# Altium project PCB_RawPrj.PrjPcb
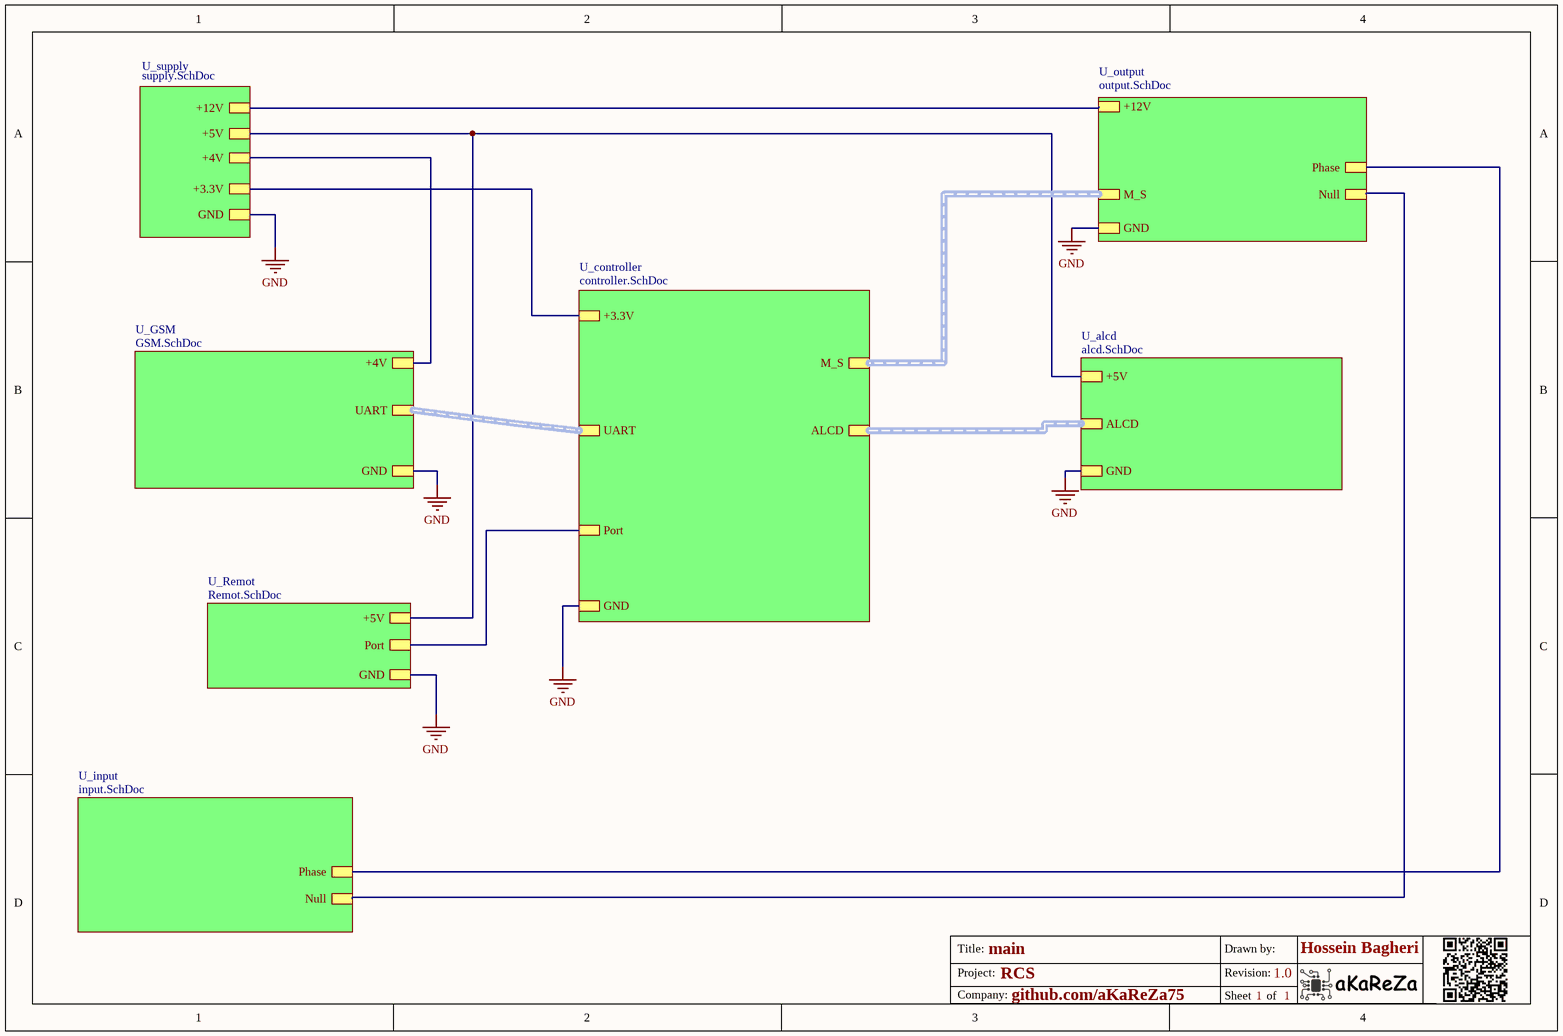
[diagram p0: main.SchDoc]
CompanyName: github.com/aKaReZa75; Project_Name: RCS; Revision: 1.0
8 sheets, 108 parts. Net scope: strictly hierarchical (ports join the sheet entries above them; power ports are local).
Board file: PCB.PcbDoc
Sheets:
  main.SchDoc
    U_alcd = alcd.SchDoc
    U_controller = controller.SchDoc
    U_GSM = GSM.SchDoc
    U_input = input.SchDoc
    U_output = output.SchDoc
    U_supply = supply.SchDoc
    U_Remot = Remot.SchDoc

## Sheet main.SchDoc: main
size A4; SheetNumber: 1; SheetTotal: 1

### Sub-sheets
U_alcd = alcd.SchDoc: GND, +5V, ALCD (harness aLCD)
U_controller = controller.SchDoc: GND, +3.3V, M_S (harness Motor signals), UART (harness UART), Port, ALCD (harness aLCD)
U_GSM = GSM.SchDoc: +4V, GND, UART (harness UART)
U_input = input.SchDoc: Null, Phase
U_output = output.SchDoc: +12V, GND, Phase, Null, M_S (harness Motor signals)
U_Remot = Remot.SchDoc: +5V, Port, GND
U_supply = supply.SchDoc: +4V, +3.3V, GND, +5V, +12V

### Nets
+3.3: sheet U_controller/+3.3V, sheet U_supply/+3.3V
+4: sheet U_GSM/+4V, sheet U_supply/+4V
+5: sheet U_alcd/+5V, sheet U_supply/+5V, sheet U_Remot/+5V
+12: sheet U_output/+12V, sheet U_supply/+12V
GND: sheet U_alcd/GND, sheet U_controller/GND, sheet U_GSM/GND, sheet U_output/GND, sheet U_supply/GND, sheet U_Remot/GND
null: sheet U_input/Null, sheet U_output/Null
phase: sheet U_input/Phase, sheet U_output/Phase
Port: sheet U_controller/Port, sheet U_Remot/Port

### Buses and harness runs
harness sheet U_alcd/ALCD = sheet U_controller/ALCD
harness sheet U_controller/M_S = sheet U_output/M_S
harness sheet U_controller/UART = sheet U_GSM/UART

### Notes on the sheet
- Title:
- Project:
- Drawn by:
- Revision:
- Hossein Bagheri
- Company:
- Sheet
- of

## Sheet alcd.SchDoc: alcd
size A4; SheetNumber: 1; SheetTotal: 1
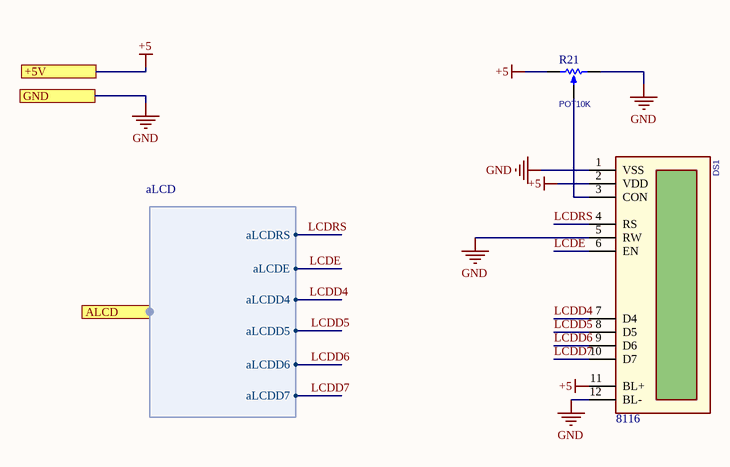
[diagram p1: alcd.SchDoc]

### Parts
DS1  Inflow: 8116  [BOX-HDR-2x6-2.54mm-S]  (hidden comment: 16x2)
R21  POT10K  [POT_3296W]

### Ports
+5V, ALCD (harness aLCD), GND

### Harnesses
aLCD: aLCDRS, aLCDE, aLCDD4, aLCDD5, aLCDD6, aLCDD7

### Nets
+5: DS1.2(VDD) DS1.11(BL+) R21.1(TOP) ; port +5V
GND: DS1.1(VSS) DS1.5(RW) DS1.12(BL-) R21.3(BOT) ; port GND
LCDD4: DS1.7(D4) ; port ALCD.aLCDD4
LCDD5: DS1.8(D5) ; port ALCD.aLCDD5
LCDD6: DS1.9(D6) ; port ALCD.aLCDD6
LCDD7: DS1.10(D7) ; port ALCD.aLCDD7
LCDE: DS1.6(EN) ; port ALCD.aLCDE
LCDRS: DS1.4(RS) ; port ALCD.aLCDRS
NetDS1_3: DS1.3(CON) R21.2(TAP)

### Notes on the sheet
- Title:
- Project:
- Drawn by:
- Revision:
- Hossein Bagheri
- Company:
- Sheet
- of

### Library data of the parts
DS1 = ModSen_LCD_CH_16x2_Box: Alphanumeric LCD character; Rating: Rating?; Validation: Valid; Value: 16x2; Package: Dip; Type: Alphanumeric
R21 = RES_THD_POT_MULTITURN: RESISTOR, THD, Potentiometer Multiturn, most Popular; VALUE: POT10K

## Sheet controller.SchDoc: supply
size A4; SheetNumber: 1; SheetTotal: 1
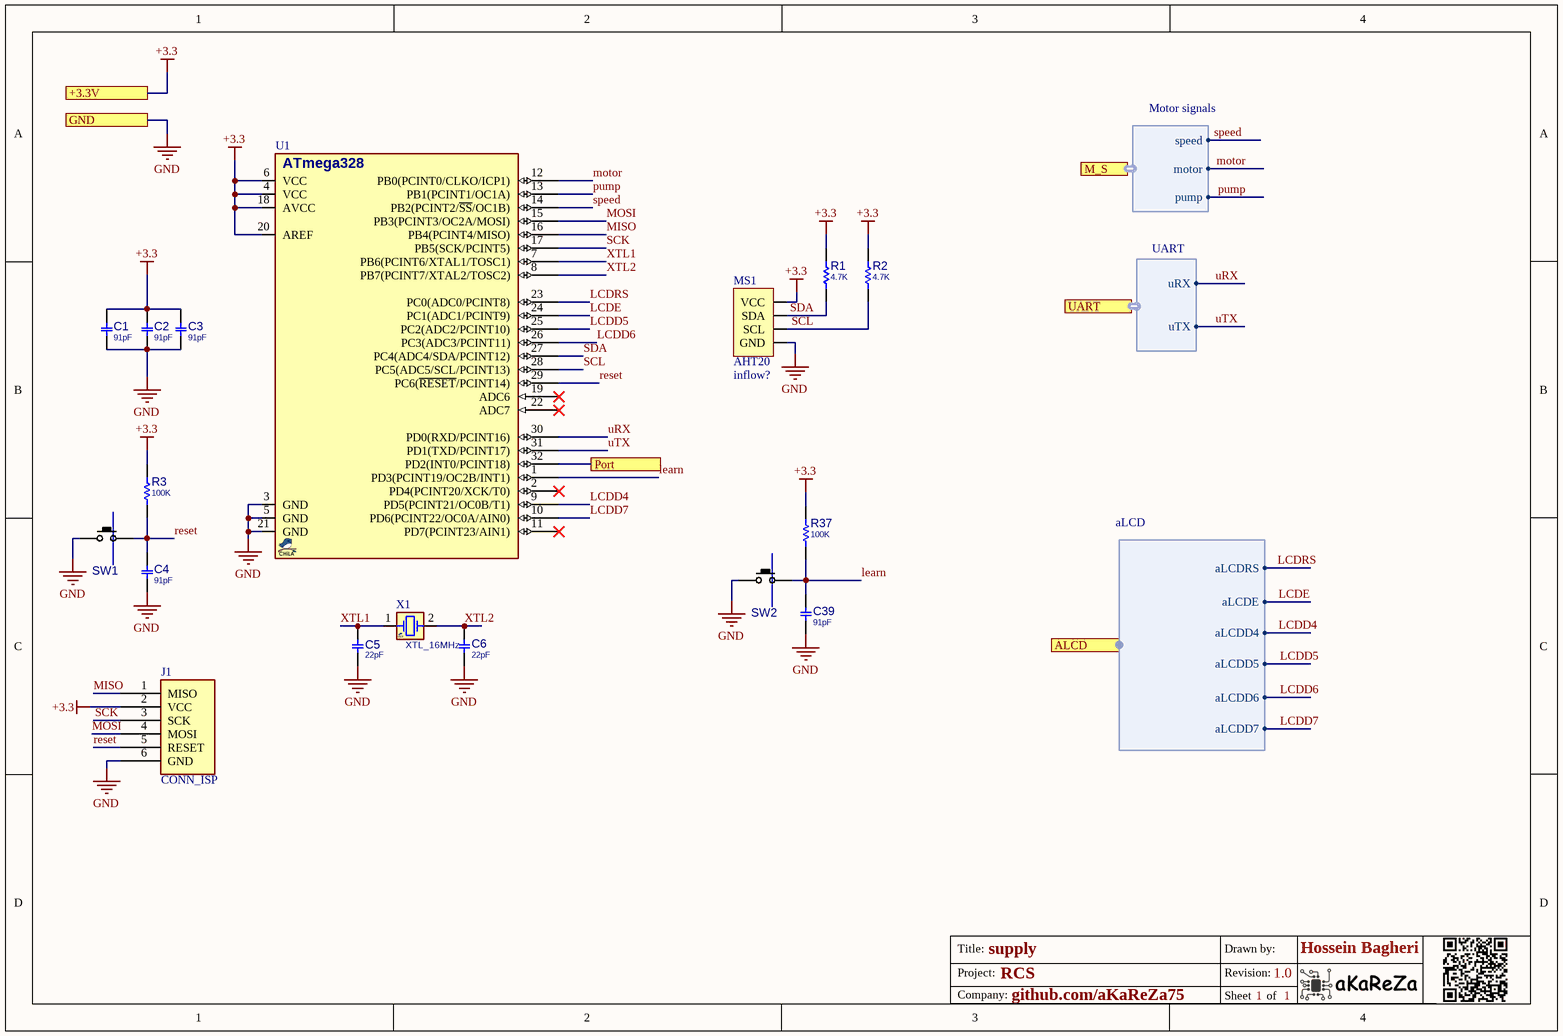
[diagram p2: controller.SchDoc]

### Parts
C1  91pF  [C0805]
C2  91pF  [C0805]
C3  91pF  [C0805]
C4  91pF  [C0805]
C5  22pF  [C0805]
C6  22pF  [C0805]
C39  91pF  [C0805]
J1  CONN_ISP  [IDC_2X3]
MS1  Inflow: inflow?  [AHT20]  (hidden comment: AHT20)
R1  4.7K  [R0805]
R2  4.7K  [R0805]
R3  100K  [R0805]
R37  100K  [R0805]
SW1  PUSHBUTTON  [SWPBS_SPST_6X3X2]  (value not drawn)
SW2  PUSHBUTTON  [SWPBS_SPST_6X3X2]  (value not drawn)
U1  ATMEGA328  [QFG80_32]  (value not drawn)
X1  XTL_16MHz  [XTL_2_11X5]

### Ports
+3.3V, ALCD (harness aLCD), GND, M_S (harness Motor signals), Port, UART (harness UART)

### Harnesses
Motor signals: speed, motor, pump
UART: uRX, uTX
aLCD: aLCDRS, aLCDE, aLCDD4, aLCDD5, aLCDD6, aLCDD7

### Nets
+3.3: C1.2 C2.2 C3.2 J1.2(VCC) MS1.4(VCC) R1.2 R2.2 R3.2 R37.2 U1.4(VCC) U1.6(VCC) U1.18(AVCC) U1.20(AREF) ; port +3.3V
GND: C1.1 C2.1 C3.1 C4.1 C5.1 C6.1 C39.1 J1.6(GND) MS1.3(GND) SW1.1(P1) SW2.1(P1) U1.3(GND) U1.5(GND) U1.21(GND) ; port GND
LCDD4: U1.9(PD5(PCINT21/OC0B/T1)) ; port ALCD.aLCDD4
LCDD5: U1.25(PC2(ADC2/PCINT10)) ; port ALCD.aLCDD5
LCDD6: U1.26(PC3(ADC3/PCINT11)) ; port ALCD.aLCDD6
LCDD7: U1.10(PD6(PCINT22/OC0A/AIN0)) ; port ALCD.aLCDD7
LCDE: U1.24(PC1(ADC1/PCINT9)) ; port ALCD.aLCDE
LCDRS: U1.23(PC0(ADC0/PCINT8)) ; port ALCD.aLCDRS
learn: C39.2 R37.1 SW2.2(P3) U1.1(PD3(PCINT19/OC2B/INT1))
MISO: J1.1(MISO) U1.16(PB4(PCINT4/MISO))
MOSI: J1.4(MOSI) U1.15(PB3(PCINT3/OC2A/MOSI))
motor: U1.12(PB0(PCINT0/CLKO/ICP1)) ; port M_S.motor
Port: U1.32(PD2(INT0/PCINT18)) ; port Port
pump: U1.13(PB1(PCINT1/OC1A)) ; port M_S.pump
reset: C4.2 J1.5(RESET) R3.1 SW1.2(P3) U1.29(PC6(~{RESET}/PCINT14))
SCK: J1.3(SCK) U1.17(PB5(SCK/PCINT5))
SCL: MS1.2(SCL) R2.1 U1.28(PC5(ADC5/SCL/PCINT13))
SDA: MS1.1(SDA) R1.1 U1.27(PC4(ADC4/SDA/PCINT12))
speed: U1.14(PB2(PCINT2/~{SS}/OC1B)) ; port M_S.speed
uRX: U1.30(PD0(RXD/PCINT16)) ; port UART.uRX
uTX: U1.31(PD1(TXD/PCINT17)) ; port UART.uTX
XTL1: C5.2 U1.7(PB6(PCINT6/XTAL1/TOSC1)) X1.1(OSC1)
XTL2: C6.2 U1.8(PB7(PCINT7/XTAL2/TOSC2)) X1.2(OSC2)

Not connected (* = marked no-connect by the designer): U1 2(PD4(PCINT20/XCK/T0))* 11(PD7(PCINT23/AIN1))* 19(ADC6)* 22(ADC7)*

### Notes on the sheet
- Title:
- Project:
- Drawn by:
- Revision:
- Hossein Bagheri
- Company:
- Sheet
- of
- (in symbol ATMEGA328_QFP32) ATmega328

### Library data of the parts
C1-C6 C39 = CAP_SMD_MLCC_2.2u50V_0805: CAP, MLCC; MANF_P#: UMK212ABJ225KG-T; MANF: Taiyo Yuden; PARAM: X5R, 10%; DIST#: MOUSER; PARAM2: 50V; ASSEMBLY: ASSEMBLY; PRICE: 100= 10$; DESC: CAP, MLCC
  C1-C4 C39: VALUE: 91pF
  C5 C6: VALUE: 22pF
J1 = CONN_AVR_ISP_IDC6: CONN, ISP, AVR , HEADER BOX; VALUE: CONN_ISP
MS1 = ModSen_AHT20: Air Temperature and Humidity Sensor; Rating: Rating?; Validation: Valid; Package: Dip; Type: Air T&H; Value: AHT20
R1-R3 R37 = RES_SMD_0805: RESISTOR, SMD; PARAM: -W; DESC: DESCRIPTION; DIST#: MOUSER; PARAM2: 1%; MANF_P#: -; MANF: -; ASSEMBLY: ASSEMBLY; PRICE: 100= 0.5$
  R1 R2: VALUE: 4.7K
  R3 R37: VALUE: 100K
SW1 SW2 = SWPBS_SPST_6X3X2_RS282: SWITCH, PUSH BUTTON, TACTILE, SMD, SPST, 6X3.5X2.5mm; MANF: C&K; DESC: DESCRIPTION; MANF_P#: RS-282G05A3-SM RT; VALUE: PUSHBUTTON; ASSEMBLY: ASSEMBLY; PARAM: PARAM; PRICE: 0.8$
U1 = ATMEGA328_QFP32: MCU, AVR, 8-Bit, 16KB, 1KB RAM, 20MHz; PART#ALT: ATmega8-48-88-168-328; MANF_P#: ATMEGA328-AU; DESC: 1KB EEPROM; MANF: ATMEL/MICROCHIP; PARAM2: 1.8~5.5V; PARAM: 32KB, 2KB RAM, 20MHz, -40~85°C; PRICE: 2.2$; VALUE: ATMEGA328
X1 = XTL_2_HC49_8MHz_SMD: Crystal MOST POPULAR ABL HC49 PACKAGE; MANF: ABRACON; MANF_P#: ABLS-8.000MHZ-B4-T; PARAM: 8MHz, 18pF, 30PPM, -20~70oC; PRICE: 0.3$; VALUE: XTL_16MHz

## Sheet GSM.SchDoc: GSM
size A4; SheetNumber: 1; SheetTotal: 1
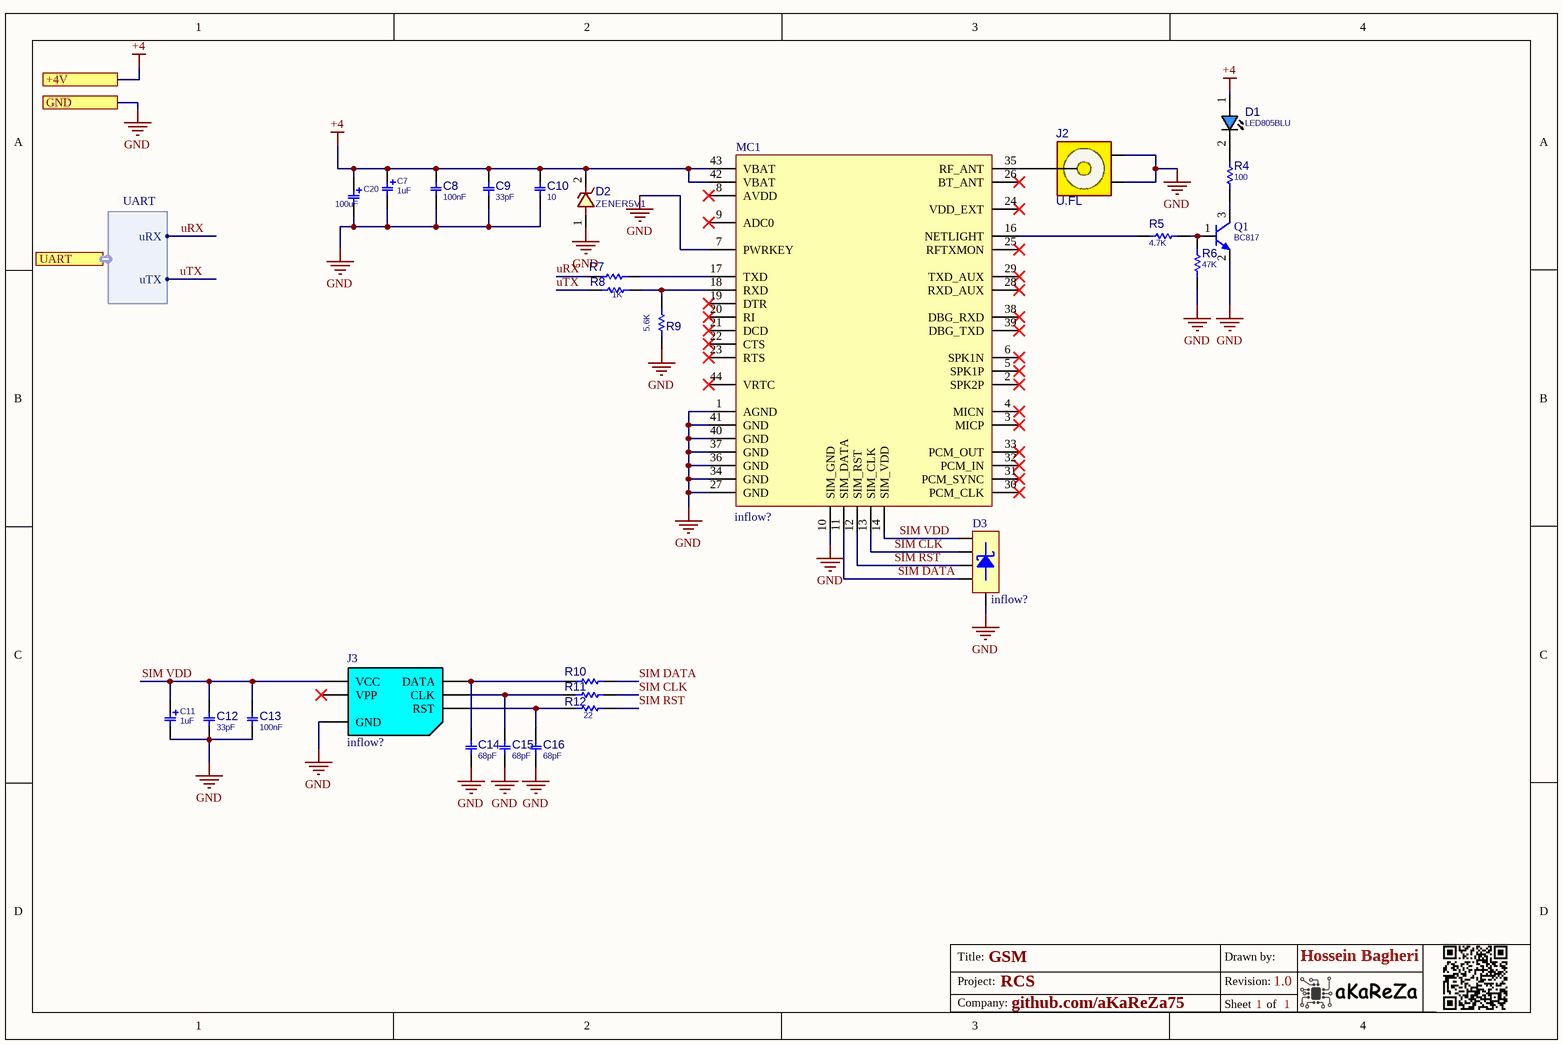
[diagram p3: GSM.SchDoc]

### Parts
C7  1uF  [C_TN_2012]
C8  100nF  [C0805]
C9  33pF  [C0805]
C10  10  [C0805]
C11  1uF  [C_TN_2012]
C12  33pF  [C0805]
C13  100nF  [C0805]
C14  68pF  [C0805]
C15  68pF  [C0805]
C16  68pF  [C0805]
C20  100uF  [C_TN_3528]
D1  LED805BLU  [LED0805BLU]
D2  ZENER5V1  [D_SOD123W]
D3  Inflow: inflow?  [SC70-5_N]  (hidden comment: SMF-05)
J2  U.FL  [UFL]
J3  Inflow: inflow?  [GCT_SIM8051]  (hidden comment: 6'Pin)
MC1  Inflow: inflow?  [m66]  (hidden comment: M66)
Q1  BC817  [SOT23_3]
R4  100  [R0805]
R5  4.7K  [R0805]
R6  47K  [R0805]
R7  1K  [R0805]
R8  22  [R0805]  (value not drawn)
R9  5.6K  [R0805]
R10  22  [R0805]  (value not drawn)
R11  22  [R0805]  (value not drawn)
R12  22  [R0805]

### Ports
+4V, GND, UART (harness UART)

### Harnesses
UART: uRX, uTX

### Nets
+4: C7.1 C8.2 C9.2 C10.2 C20.1 D1.1(ANODE) D2.2 MC1.42(VBAT) MC1.43(VBAT) ; port +4V
GND: C7.2 C8.1 C9.1 C10.1 C11.2 C12.1 C13.1 C14.1 C15.1 C16.1 C20.2 D2.1 D3.2(K) J2.2(G1) J2.3(G2) J3.5(GND) MC1.1(AGND) MC1.7(PWRKEY) MC1.10(SIM_GND) MC1.27(GND) MC1.34(GND) MC1.36(GND) MC1.37(GND) MC1.40(GND) MC1.41(GND) Q1.2(E) R6.1 R9.2 ; port GND
SIM CLK: D3.4(K) MC1.13(SIM_CLK) R11.1
SIM DATA: D3.5(K) MC1.11(SIM_DATA) R10.1
SIM RST: D3.1(K) MC1.12(SIM_RST) R12.1
SIM VDD: C11.1 C12.2 C13.2 D3.3(K) J3.1(VCC) MC1.14(SIM_VDD)
uRX: R7.2 ; port UART.uRX
uTX: R8.2 ; port UART.uTX
NetC14_2: C14.2 J3.4(DATA) R10.2
NetC15_2: C15.2 J3.3(CLK) R11.2
NetC16_2: C16.2 J3.2(RST) R12.2
NetD1_2: D1.2(CATHODE) R4.2
NetJ2_1: J2.1(SIG) MC1.35(RF_ANT)
NetMC1_16: MC1.16(NETLIGHT) R5.2
NetMC1_17: MC1.17(TXD) R7.1
NetMC1_18: MC1.18(RXD) R8.1 R9.1
NetQ1_1: Q1.1(B) R5.1 R6.2
NetQ1_3: Q1.3(C) R4.1

Not connected (* = marked no-connect by the designer): J3 6(VPP)*; MC1 2(SPK2P)* 3(MICP)* 4(MICN)* 5(SPK1P)* 6(SPK1N)* 8(AVDD)* 9(ADC0)* 19(DTR)* 20(RI)* 21(DCD)* 22(CTS)* 23(RTS)* 24(VDD_EXT)* 25(RFTXMON)* 26(BT_ANT)* 28(RXD_AUX)* 29(TXD_AUX)* 30(PCM_CLK)* 31(PCM_SYNC)* 32(PCM_IN)* 33(PCM_OUT)* 38(DBG_RXD)* 39(DBG_TXD)* 44(VRTC)*

### Notes on the sheet
- Title:
- Project:
- Drawn by:
- Revision:
- Hossein Bagheri
- Company:
- Sheet
- of

### Library data of the parts
C7 C11 = CAP_SMD_TAN: CAP, SMD, TAN,; PARAM2: 6.3V; VALUE: 1uF
C8-C10 C12-C16 = CAP_SMD_MLCC_2.2u50V_0805: as C1 on sheet controller; ASSEMBLY: ASSEMBLY; PRICE: 100= 10$; DESC: CAP, MLCC
  C8 C13: VALUE: 100nF
  C9 C12: VALUE: 33pF
  C10: VALUE: 10
  C14-C16: VALUE: 68pF
C20 = CAP_SMD_TAN_10uF_16V: CAP, SMD, TAN; PARAM: 20%, 200mOhm, -55~105oC; MANF: AVX; MANF_P#: TCJT106M016R0200; PARAM2: 25V; PRICE: 1$; VALUE: 100uF
D1 = LED_SMD_0805_BLU: LED, SMD, 0805, BLUE; DESC: DESCRIPTION; MANF_P#: MANF_PART#; PARAM2: 2.2V; MANF: MANF; ASSEMBLY: ASSEMBLY; PRICE: 36t@Javan; VALUE: LED805BLU
D2 = DIODE_SMD_ZENER_BZT52HC5V1: DIODE, ZENER, 1W, 5.1V; MANF: Diodes; DESC: DESCRIPTION; PARAM2: 1W, 4Ohm, -55~150oC; MANF_P#: BZT52HC5V1WF-7; ASSEMBLY: ASSEMBLY; PRICE: 0.25$; PARAM: 5.1V; VALUE: ZENER5V1
D3 = Semi_Diod_TVS_SMF05: TVS Diode Array; Rating: Rating?; Validation: Valid; Type: TVS; Value: SMF-05; Package: SC70-5
J2 = CONN_RF_UFL: CONN, RF, U.FL, STRAIGHT, Ultra Miniature Coaxial; MANF_P#: CONUFL001-SMD, U.FL-R-SMT-1(10), 128-0711-201; MANF: Linx, Hirose, Cinch; PARAM: 50Ohm, 6GHz; DESC: DESCRIPTION; DIST#: DIGIKEY, MOUSER; PARAM2: GOLD; ASSEMBLY: ASSEMBLY; PRICE: 0.9$; VALUE: U.FL
J3 = Con_Socket_SimCard_1: Nano SimCard Holder 6P; Rating: Rating?; Validation: Valid; Package: SMD; Type: Nano; Value: 6'Pin
MC1 = ModSen_Com_M66: Quectel GSM/GPRS Module; Rating: Rating?; Validation: Valid; Package: Dip; Value: M66; Type: GSM-GPRS
Q1 = NPN_BC817_SOT23: BJT, NPN, 45v, 0.5A, SMD, SOT23; PARAM: 0.5A, Hfe100~600; PARAM2: 45v, 250mW; MANF: NXP, ON; MANF_P#: BC817; VALUE: BC817
R4-R12 = RES_SMD_0805: as R1 on sheet controller; MANF_P#: -; MANF: -; ASSEMBLY: ASSEMBLY; PRICE: 100= 0.5$
  R4: VALUE: 100
  R5: VALUE: 4.7K
  R6: VALUE: 47K
  R7: VALUE: 1K
  R8 R10-R12: VALUE: 22
  R9: VALUE: 5.6K

## Sheet input.SchDoc: supply
size A4; SheetNumber: 1; SheetTotal: 1
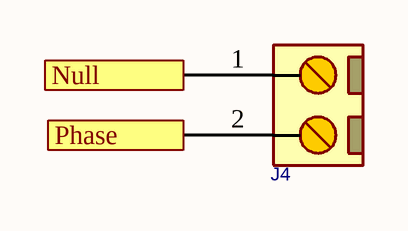
[diagram p4: input.SchDoc]

### Parts
J4  CONN_GMSTB2  [GMSTB762_2]  (value not drawn)

### Ports
Null, Phase

### Nets
null: J4.1 ; port Null
phase: J4.2 ; port Phase

### Notes on the sheet
- Title:
- Project:
- Drawn by:
- Revision:
- Hossein Bagheri
- Company:
- Sheet
- of

### Library data of the parts
J4 = CONN_GMSTB762_2: CONN, PHOENIX GMSTB, 7.62mm pitch; MANF_P#: GMSTB 2,5/2-G-7,62; VALUE: CONN_GMSTB2

## Sheet output.SchDoc: output
size A4; SheetNumber: 1; SheetTotal: 1
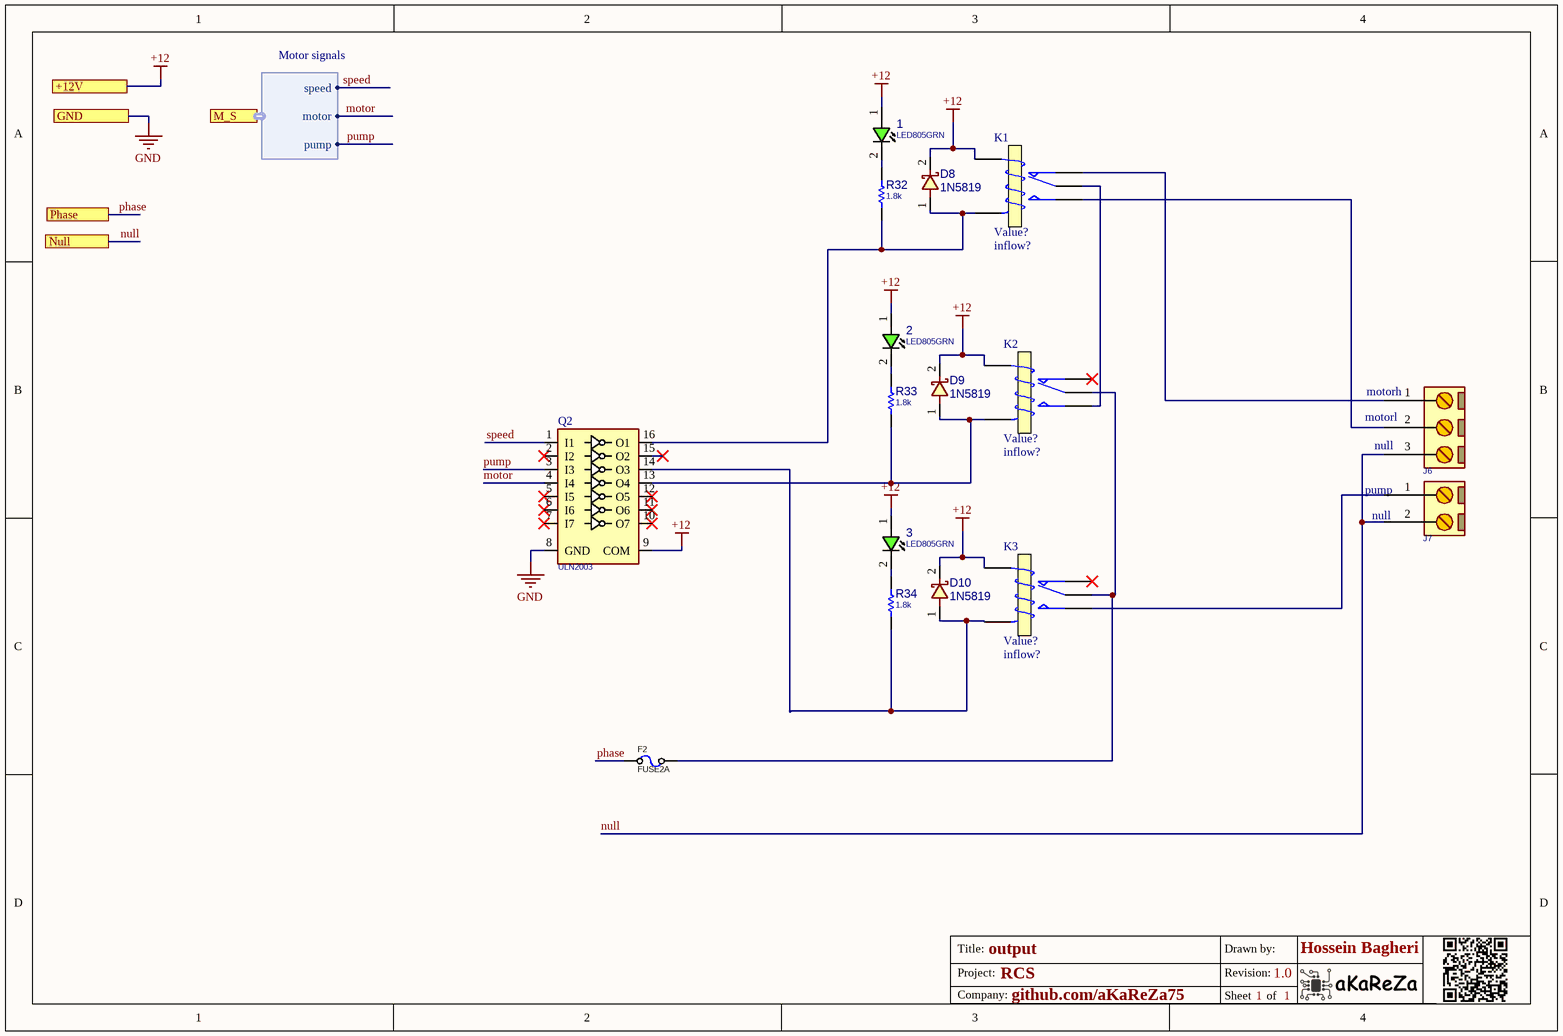
[diagram p5: output.SchDoc]

### Parts
1  LED805GRN  [LED0805GRN]
2  LED805GRN  [LED0805GRN]
3  LED805GRN  [LED0805GRN]
D8  1N5819  [D_SOD123W]
D9  1N5819  [D_SOD123W]
D10  1N5819  [D_SOD123W]
F2  FUSE2A  [FUSH_5X20MM]
J6  CONN_GMSTB3  [GMSTB762_3]  (value not drawn)
J7  CONN_GMSTB2  [GMSTB762_2]  (value not drawn)
K1  Inflow: inflow?  [Relay 15.40x12.10x13.10]  (hidden comment: Value?)
K2  Inflow: inflow?  [Relay 15.40x12.10x13.10]  (hidden comment: Value?)
K3  Inflow: inflow?  [Relay 15.40x12.10x13.10]  (hidden comment: Value?)
Q2  ULN2003  [SO_16_W]
R32  1.8k  [R0805]
R33  1.8k  [R0805]
R34  1.8k  [R0805]

### Ports
+12V, GND, M_S (harness Motor signals), Null, Phase

### Harnesses
Motor signals: speed, motor, pump

### Nets
+12: 1.1(ANODE) 2.1(ANODE) 3.1(ANODE) D8.2 D9.2 D10.2 K1.4(T1) K2.4(T1) K3.4(T1) Q2.9(COM) ; port +12V
GND: Q2.8(GND) ; port GND
motor: Q2.4(I4) ; port M_S.motor
null: J6.3 J7.2 ; port Null
phase: F2.1 ; port Phase
pump: Q2.3(I3) ; port M_S.pump
speed: Q2.1(I1) ; port M_S.speed
Net1_2: 1.2(CATHODE) R32.2
Net2_2: 2.2(CATHODE) R33.2
Net3_2: 3.2(CATHODE) R34.2
NetD8_1: D8.1 K1.5(T2) Q2.16(O1) R32.1
NetD9_1: D9.1 K2.5(T2) Q2.13(O4) R33.1
NetD10_1: D10.1 K3.5(T2) Q2.14(O3) R34.1
NetF2_2: F2.2 K2.1(COM) K3.1(COM)
NetJ6_1: J6.1 K1.2(NC)
NetJ6_2: J6.2 K1.3(NO)
NetJ7_1: J7.1 K3.3(NO)
NetK1_1: K1.1(COM) K2.3(NO)

Not connected (* = marked no-connect by the designer): K2 2(NC)*; K3 2(NC)*; Q2 2(I2)* 5(I5)* 6(I6)* 7(I7)* 10(O7)* 11(O6)* 12(O5)* 15(O2)*

### Notes on the sheet
- (near J6) motorl
- (near J6) motorh
- (near J6) null
- pump
- (near J7) null
- Title:
- Project:
- Drawn by:
- Revision:
- Hossein Bagheri
- Company:
- Sheet
- of

### Library data of the parts
1-3 = LED_SMD_0805_GRN: LED, SMD, 0805, GREEN; PARAM: 20mA; DESC: DESCRIPTION; PARAM2: 2.2V; MANF: -; ASSEMBLY: ASSEMBLY; PRICE: 36t@Javan; MANF_P#: -; VALUE: LED805GRN
D8-D10 = DIODE_SMD_SCHOTTKY_1N5819: DIODE, SCHOTTKY, 40V, 1A; MANF: DIODES; MANF_P#: 1N5819HW-7-F; DESC: DESCRIPTION; ASSEMBLY: ASSEMBLY; PRICE: PRICE; PARAM2: 1A; PARAM: 40V; VALUE: 1N5819
F2 = FUSE_5X20: Fuse HOLDER 5X20; PARAM: 2A; MANF_P#: MANF_PART#; MANF: MANF; PARAM2: PARAM2; VALUE: FUSE2A
J6 = CONN_GMSTB762_3: CONN, PHOENIX MSTB, 5-G, 5.08mm pitch; MANF_P#: GMSTB 2,5/3-G-7,62; VALUE: CONN_GMSTB3
J7 = CONN_GMSTB762_2: as J4 on sheet input; VALUE: CONN_GMSTB2
K1-K3 = SW_Relay_SPDT: SPDT Relay; Rating: Rating?; Validation: Valid; Type: SPDT; Package: Dip; Value: Value?
Q2 = ULN2003_SOP16: Darlington, 7-CH, 50V, 0.5A; MANF_P#: ULN2003A; MANF: DIODES; PARAM: 7-CH, 50V, 0.5A; PARAM2: -; VALUE: ULN2003
R32-R34 = RES_SMD_0805: as R1 on sheet controller; MANF_P#: -; MANF: -; ASSEMBLY: ASSEMBLY; PRICE: 100= 0.5$; VALUE: 1.8k

## Sheet supply.SchDoc: supply
size A4; SheetNumber: 1; SheetTotal: 1
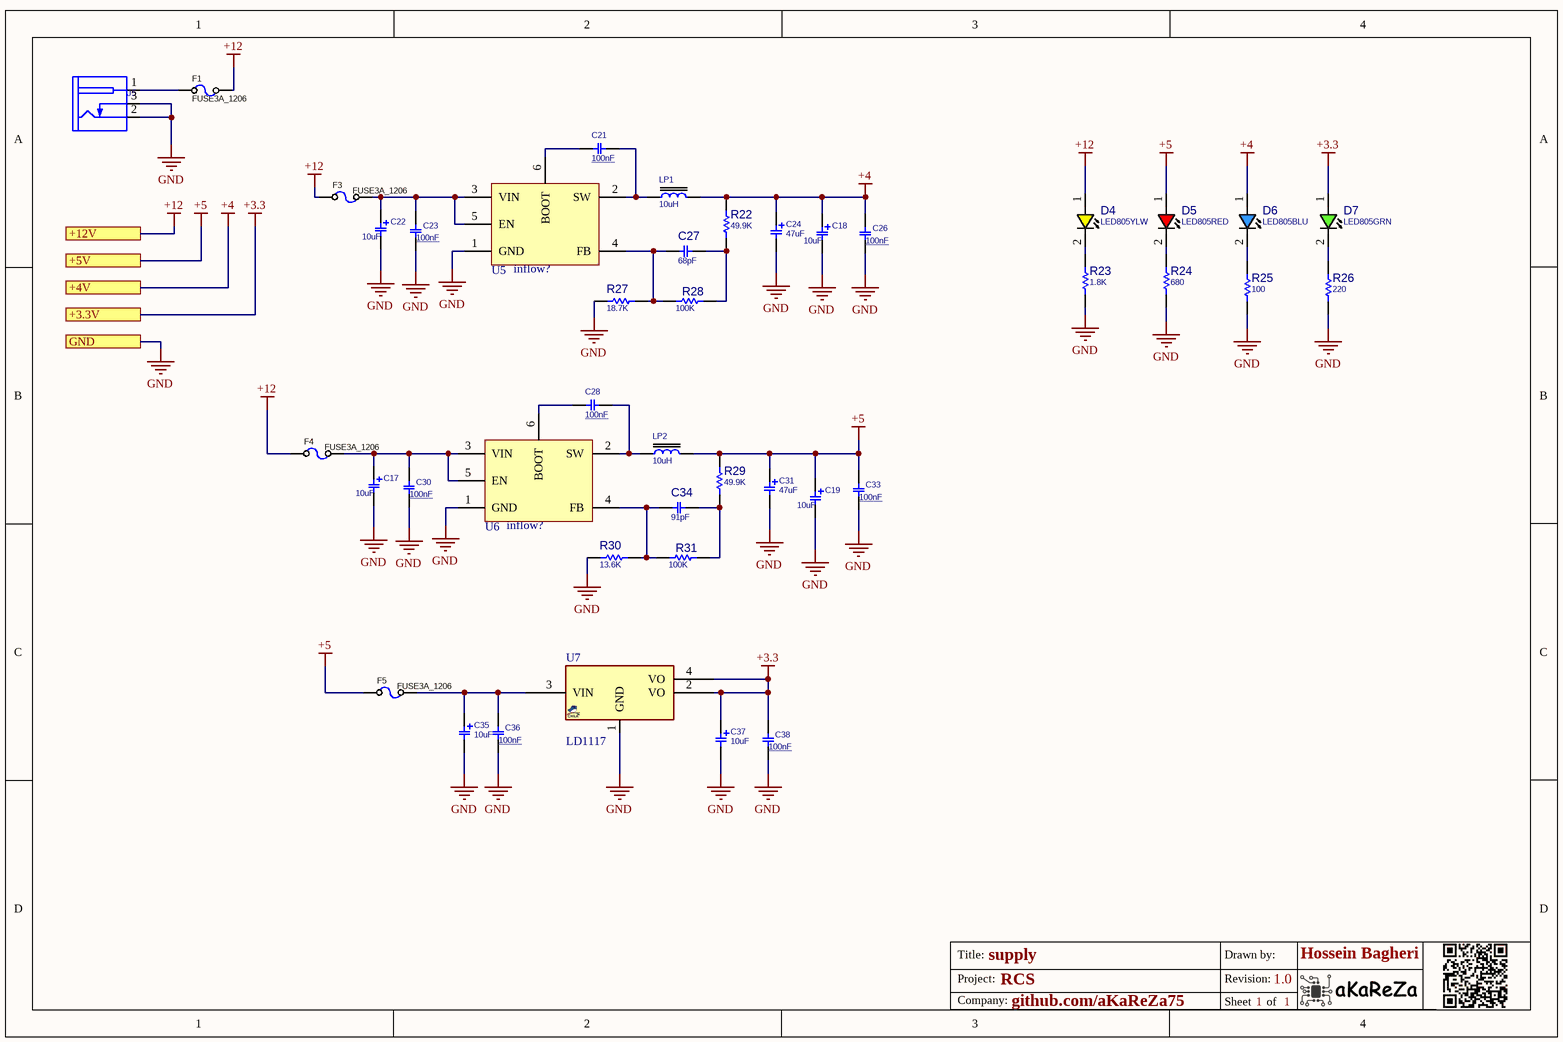
[diagram p6: supply.SchDoc]

### Parts
C17  10uF  [C_TN_3528]
C18  10uF  [C_TN_3528]
C19  10uF  [C_TN_3528]
C21  100nF  [C1206]
C22  10uF  [C_TN_3528]
C23  100nF  [C1206]
C24  47uF  [C_TN_2012]
C26  100nF  [C1206]
C27  68pF  [C0805]
C28  100nF  [C1206]
C30  100nF  [C1206]
C31  47uF  [C_TN_2012]
C33  100nF  [C1206]
C34  91pF  [C0805]
C35  10uF  [C_TN_2012]
C36  100nF  [C1206]
C37  10uF  [C_TN_2012]
C38  100nF  [C1206]
D4  LED805YLW  [LED0805YLW]
D5  LED805RED  [LED0805RED]
D6  LED805BLU  [LED0805BLU]
D7  LED805GRN  [LED0805GRN]
F1  FUSE3A_1206  [F1206]
F3  FUSE3A_1206  [F1206]
F4  FUSE3A_1206  [F1206]
F5  FUSE3A_1206  [F1206]
J5  DC_POWER_JACK  [JAC_PWR2]  (value not drawn)
LP1  10uH  [L_7]
LP2  10uH  [L_7]
R22  49.9K  [R0805]
R23  1.8K  [R0805]
R24  680  [R0805]
R25  100  [R0805]
R26  220  [R0805]
R27  18.7K  [R0805]
R28  100K  [R0805]
R29  49.9K  [R0805]
R30  13.6K  [R0805]
R31  100K  [R0805]
U5  Inflow: inflow?  [TPS54302]  (hidden comment: Value?)
U6  Inflow: inflow?  [TPS54302]  (hidden comment: Value?)
U7  LD1117  [SOT223_4]

### Ports
+3.3V, +4V, +5V, +12V, GND

### Nets
+3.3: C37.1 C38.2 D7.1(ANODE) U7.2(VO) U7.4(VO) ; port +3.3V
+4: C18.1 C24.1 C26.2 D6.1(ANODE) LP1.2 R22.2 ; port +4V
+5: C19.1 C31.1 C33.2 D5.1(ANODE) F5.1 LP2.2 R29.2 ; port +5V
+12: D4.1(ANODE) F1.2 F3.1 F4.1 ; port +12V
GND: C17.2 C18.2 C19.2 C22.2 C23.1 C24.2 C26.1 C30.1 C31.2 C33.1 C35.2 C36.1 C37.2 C38.1 J5.2(SLEEVE) J5.3(INSERTION_DET) R23.1 R24.1 R25.1 R26.1 R27.1 R30.1 U5.1(GND) U6.1(GND) U7.1(GND) ; port GND
NetC17_1: C17.1 C30.2 F4.2 U6.3(VIN) U6.5(EN)
NetC21_1: C21.1 LP1.1 U5.2(SW)
NetC21_2: C21.2 U5.6(BOOT)
NetC22_1: C22.1 C23.2 F3.2 U5.3(VIN) U5.5(EN)
NetC27_1: C27.1 R27.2 R28.1 U5.4(FB)
NetC27_2: C27.2 R22.1 R28.2
NetC28_1: C28.1 LP2.1 U6.2(SW)
NetC28_2: C28.2 U6.6(BOOT)
NetC34_1: C34.1 R30.2 R31.1 U6.4(FB)
NetC34_2: C34.2 R29.1 R31.2
NetC35_1: C35.1 C36.2 F5.2 U7.3(VIN)
NetD4_2: D4.2(CATHODE) R23.2
NetD5_2: D5.2(CATHODE) R24.2
NetD6_2: D6.2(CATHODE) R25.2
NetD7_2: D7.2(CATHODE) R26.2
NetF1_1: F1.1 J5.1(TIP)

### Notes on the sheet
- Title:
- Project:
- Drawn by:
- Revision:
- Hossein Bagheri
- Company:
- Sheet
- of

### Library data of the parts
C17-C19 C22 = CAP_SMD_TAN_10uF_16V: as C20 on sheet GSM; PRICE: 1$; VALUE: 10uF
C21 C23 C26 C28 C30 C33 C36 C38 = CAP_SMD_MLCC_1206: CAP, MLCC, -F, -V, MATERIAL, -%, 0201; PARAM: -, -%; MANF_P#: MANF_PART#; PRICE: 100= 1$; MANF: -; PARAM2: -V; ASSEMBLY: ASSEMBLY; VALUE: 100nF
C24 C31 C35 C37 = CAP_SMD_TAN: CAP, SMD, TAN,; PARAM2: 6.3V
  C24 C31: VALUE: 47uF
  C35 C37: VALUE: 10uF
C27 C34 = CAP_SMD_MLCC_2.2u50V_0805: as C1 on sheet controller; ASSEMBLY: ASSEMBLY; PRICE: 100= 10$; DESC: CAP, MLCC
  C27: VALUE: 68pF
  C34: VALUE: 91pF
D4 = LED_SMD_0805_YLW: LED, SMD, 0805, YELLOW; DESC: DESCRIPTION; MANF_P#: MANF_PART#; PARAM2: 2.2V; MANF: MANF; ASSEMBLY: ASSEMBLY; PRICE: 36t@Javan; VALUE: LED805YLW
D5 = LED_SMD_0805_RED: LED, SMD, 0805, RED; DESC: DESCRIPTION; MANF_P#: MANF_PART#; PARAM2: 2.2V; MANF: MANF; ASSEMBLY: ASSEMBLY; PRICE: 36t@Javan; VALUE: LED805RED
D6 = LED_SMD_0805_BLU: as D1 on sheet GSM; MANF: MANF; ASSEMBLY: ASSEMBLY; PRICE: 36t@Javan; VALUE: LED805BLU
D7 = LED_SMD_0805_GRN: as 1 on sheet output; MANF: -; ASSEMBLY: ASSEMBLY; PRICE: 36t@Javan; MANF_P#: -; VALUE: LED805GRN
F1 F3-F5 = FUSE_3A_1206_SLOW: Fuse, 3A, 32VDC, 1206, SMD, Slow Blow; PARAM: 3A; 32VDC; Slow Blow; MANF: Bourns; MANF_P#: SF-1206SP300-2; PARAM2: 0.027Ohm; PRICE: 0.9$; VALUE: FUSE3A_1206
J5 = CONN_PWR_JACKR2: CONN, PWR JACK DC, PLUG DIAM 2.0MM RA THD; MANF: CUI STACK; MANF_P#: PJ-202A, PJ-002AH, PJ-102AH, KLDX-0202; VALUE: DC_POWER_JACK
LP1 = IND_SMD_3.3uH_8A: INDUCTOR, 10uH, 8A (Irms), 10mOhm; PARAM: 8A (Irms), 12A Isat; DESC: INDUCTOR, 3.3uH, 8A (Irms), 10mOhm; MANF: Bourns; MANF_P#: SRP7050TA-3R3M; PRICE: 1.3$; PARAM2: 10mOhm; ASSEMBLY: ASSEMBLY; VALUE: 10uH
LP2 = IND_SMD_3.3uH_8A: INDUCTOR, 10uH, 8A (Irms), 10mOhm; PARAM: 3A (Irms), 3.5 Isat; DESC: INDUCTOR, 3.3uH, 8A (Irms), 10mOhm; MANF: Bourns; MANF_P#: SRP7050TA-3R3M; PRICE: 1.3$; PARAM2: 10mOhm; ASSEMBLY: ASSEMBLY; VALUE: 10uH
R22-R31 = RES_SMD_0805: as R1 on sheet controller; MANF_P#: -; MANF: -; ASSEMBLY: ASSEMBLY; PRICE: 100= 0.5$
  R22 R29: VALUE: 49.9K
  R23: VALUE: 1.8K
  R24: VALUE: 680
  R25: VALUE: 100
  R26: VALUE: 220
  R27: VALUE: 18.7K
  R28 R31: VALUE: 100K
  R30: VALUE: 13.6K
U5 U6 = IC_Reg_TPS54302: 3'A Synchronous Step-Down Converter; Rating: S; Validation: Valid; Value: Value?; Type: Switching; Package: SOT-23-6
U7 = VREG_1117_SOT223: REG, Linear, LDO1V, 0.8A, SOT-223; MANF_P#: LD1117, LM1117, AMS1117, TLV1117, REG1117, NCP1117, LT1117, SPX1117; MANF: TI, ON, ST; PARAM2: 1.2/1.5/1.8/2.5/2.85/3.3/5V; PARAM: LDO1V, 0.8A; VALUE: LD1117

## Sheet Remot.SchDoc: GSM
size A4; SheetNumber: 1; SheetTotal: 1
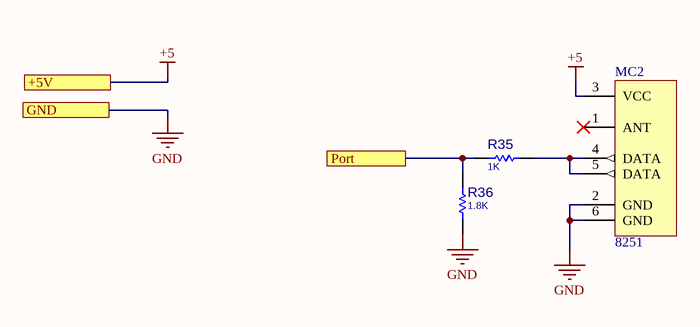
[diagram p7: Remot.SchDoc]

### Parts
MC2  Inflow: 8251  [RF_ETRXB]  (hidden comment: RXB22)
R35  1K  [R0805]
R36  1.8K  [R0805]

### Ports
+5V, GND, Port

### Nets
+5: MC2.3(VCC) ; port +5V
GND: MC2.2(GND) MC2.6(GND) R36.1 ; port GND
Port: R35.2 R36.2 ; port Port
NetMC2_4: MC2.4(DATA) MC2.5(DATA) R35.1

Not connected (* = marked no-connect by the designer): MC2 1(ANT)*

### Notes on the sheet
- Title:
- Project:
- Drawn by:
- Revision:
- Hossein Bagheri
- Company:
- Sheet
- of

### Library data of the parts
MC2 = ModSen_Com_RXB22_433: JMR RXB22 433MHz ASK superheterodyne wireless receiving module; Rating: 433M; Validation: Valid; Value: RXB22; Package: Dip; Type: Learning
R35 R36 = RES_SMD_0805: as R1 on sheet controller; MANF_P#: -; MANF: -; ASSEMBLY: ASSEMBLY; PRICE: 100= 0.5$
  R35: VALUE: 1K
  R36: VALUE: 1.8K

## Nets that join several sheets
+3.3: controller (13 pins), supply (5 pins)
+4: GSM (9 pins), supply (6 pins)
+5: alcd (DS1.2 DS1.11 R21.1), supply (7 pins), Remot (MC2.3)
+12: output (10 pins), supply (D4.1 F1.2 F3.1 F4.1)
GND: alcd (DS1.1 DS1.5 DS1.12 R21.3), controller (14 pins), GSM (28 pins), output (Q2.8), supply (25 pins), Remot (MC2.2 MC2.6 R36.1)
LCDD4: alcd (DS1.7), controller (U1.9)
LCDD5: alcd (DS1.8), controller (U1.25)
LCDD6: alcd (DS1.9), controller (U1.26)
LCDD7: alcd (DS1.10), controller (U1.10)
LCDE: alcd (DS1.6), controller (U1.24)
LCDRS: alcd (DS1.4), controller (U1.23)
motor: controller (U1.12), output (Q2.4)
null: input (J4.1), output (J6.3 J7.2)
phase: input (J4.2), output (F2.1)
Port: controller (U1.32), Remot (R35.2 R36.2)
pump: controller (U1.13), output (Q2.3)
speed: controller (U1.14), output (Q2.1)
uRX: controller (U1.30), GSM (R7.2)
uTX: controller (U1.31), GSM (R8.2)